# EasyEDA Pro project icl7109-rp2040-precision-meter_2025-05-16.epro, board icl7109-rp2040-precision-meter
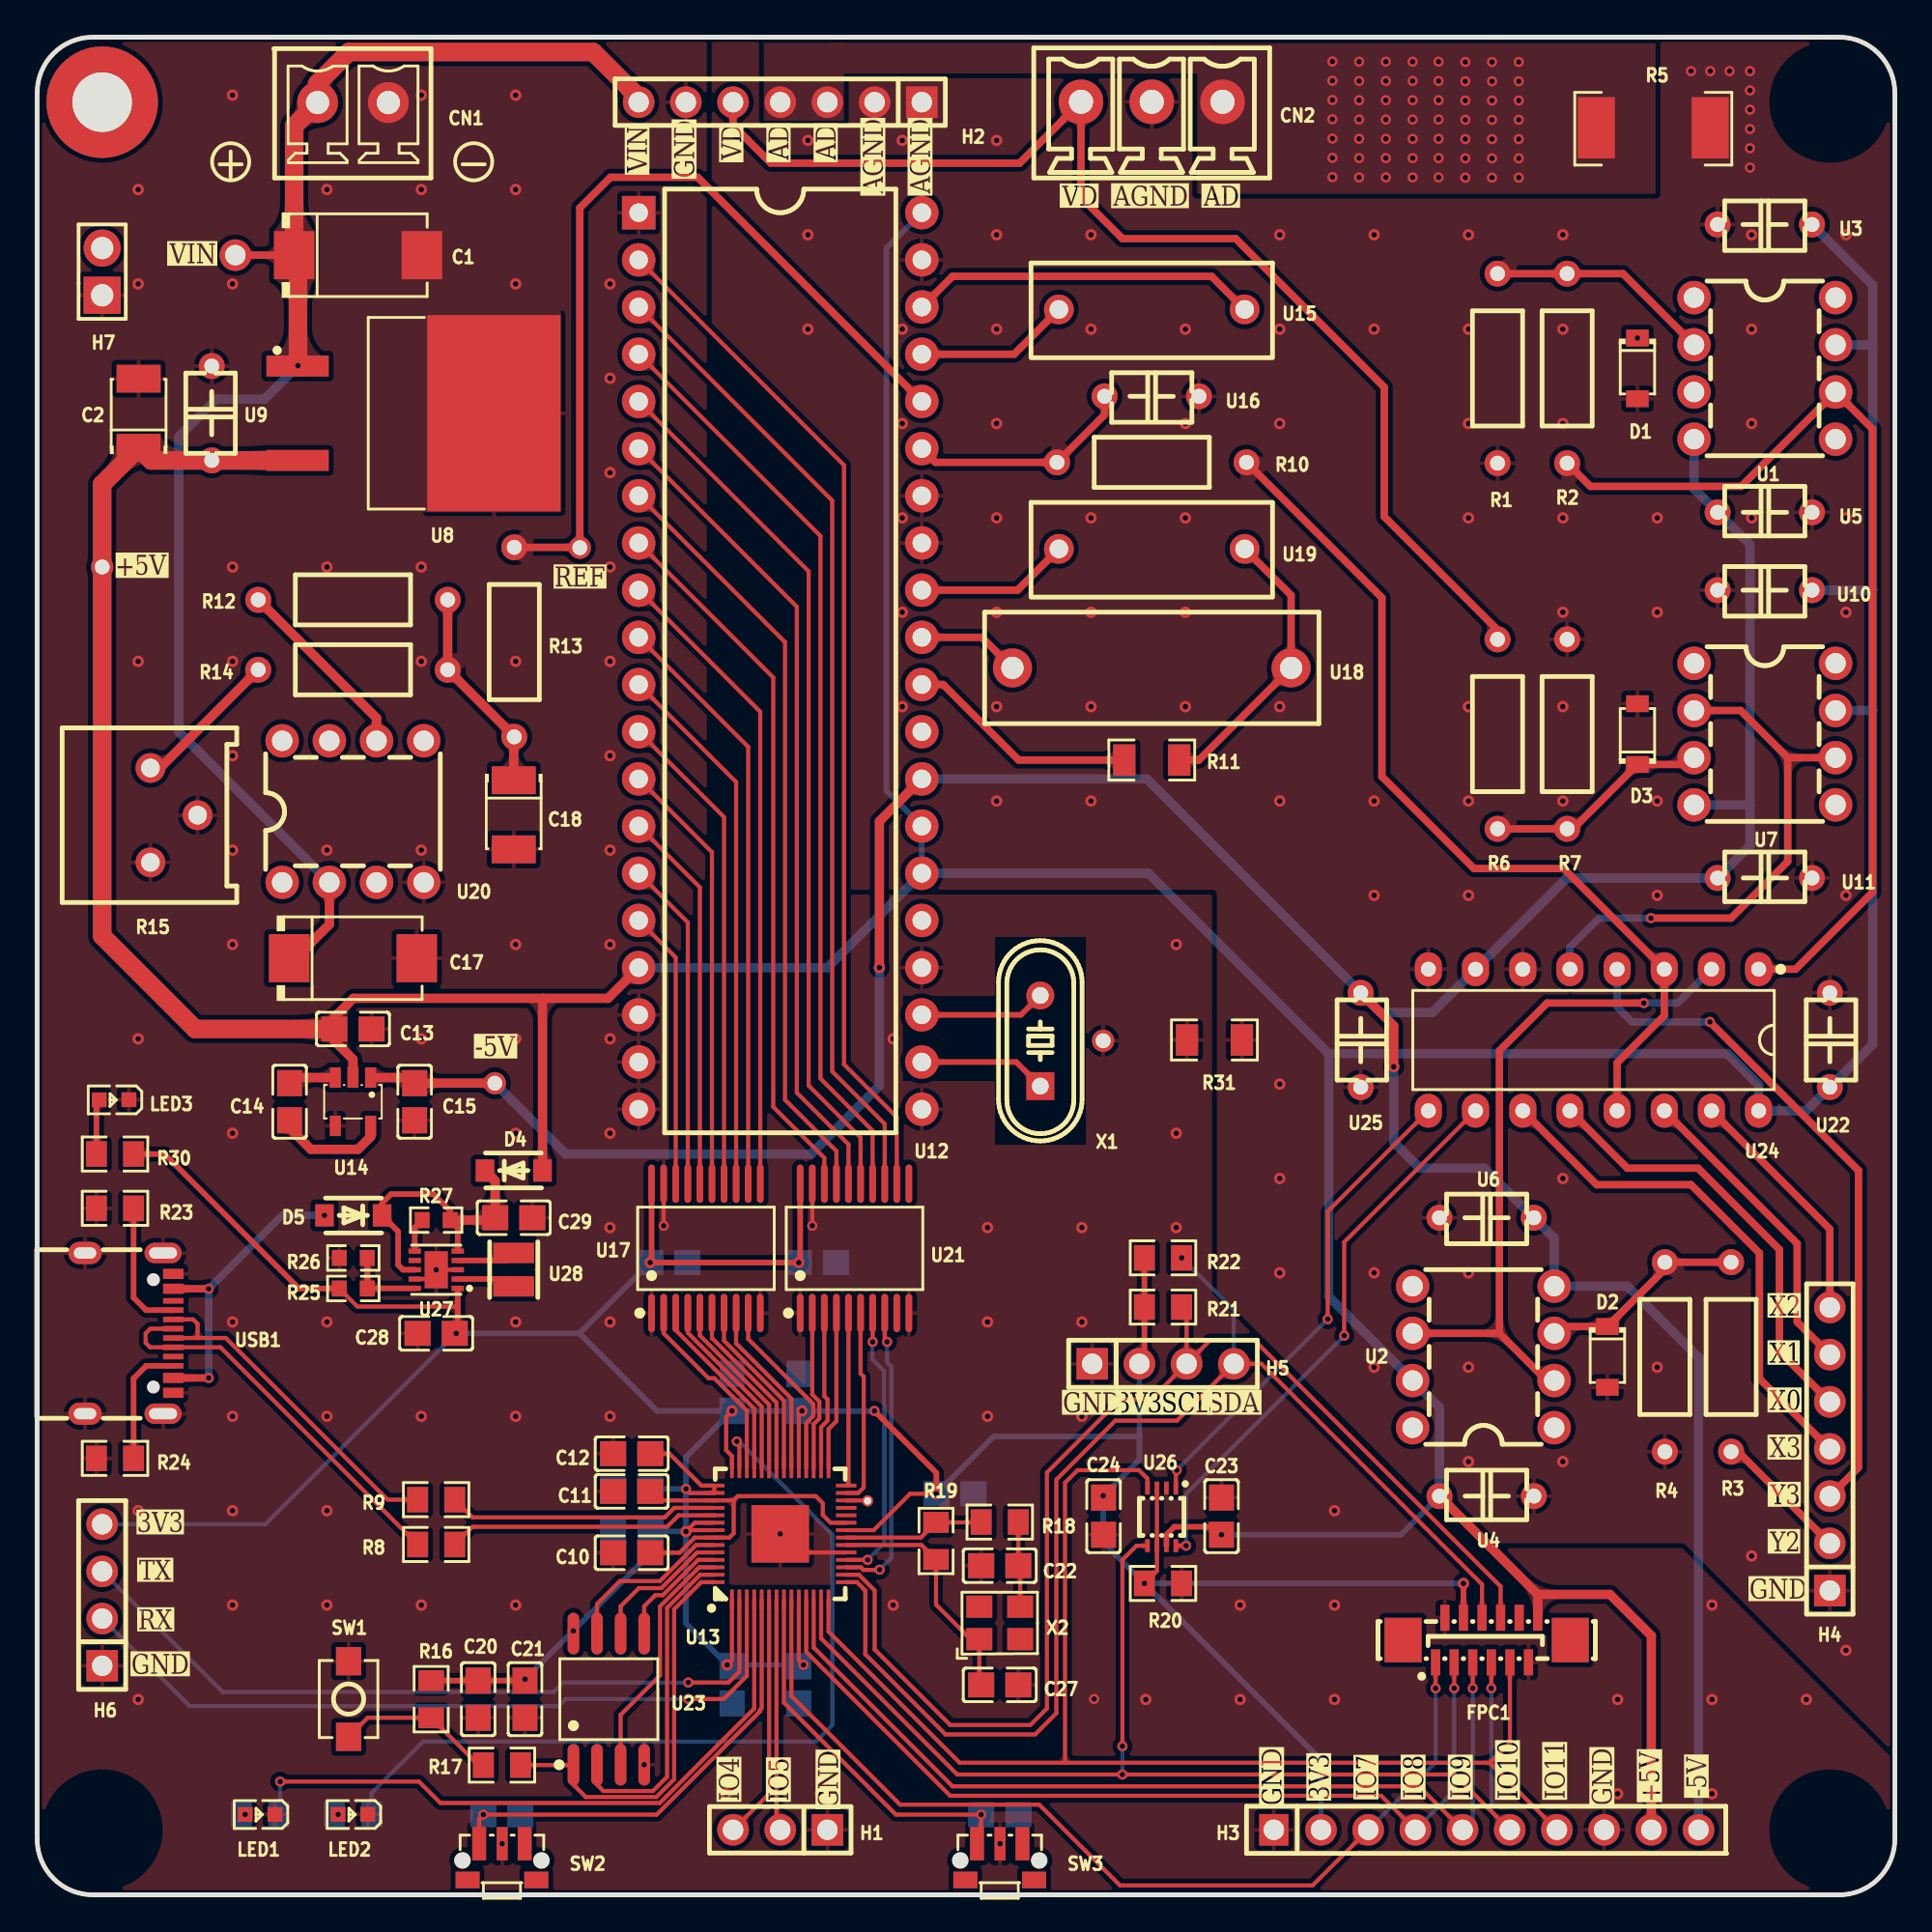
[diagram p1: board, top side]
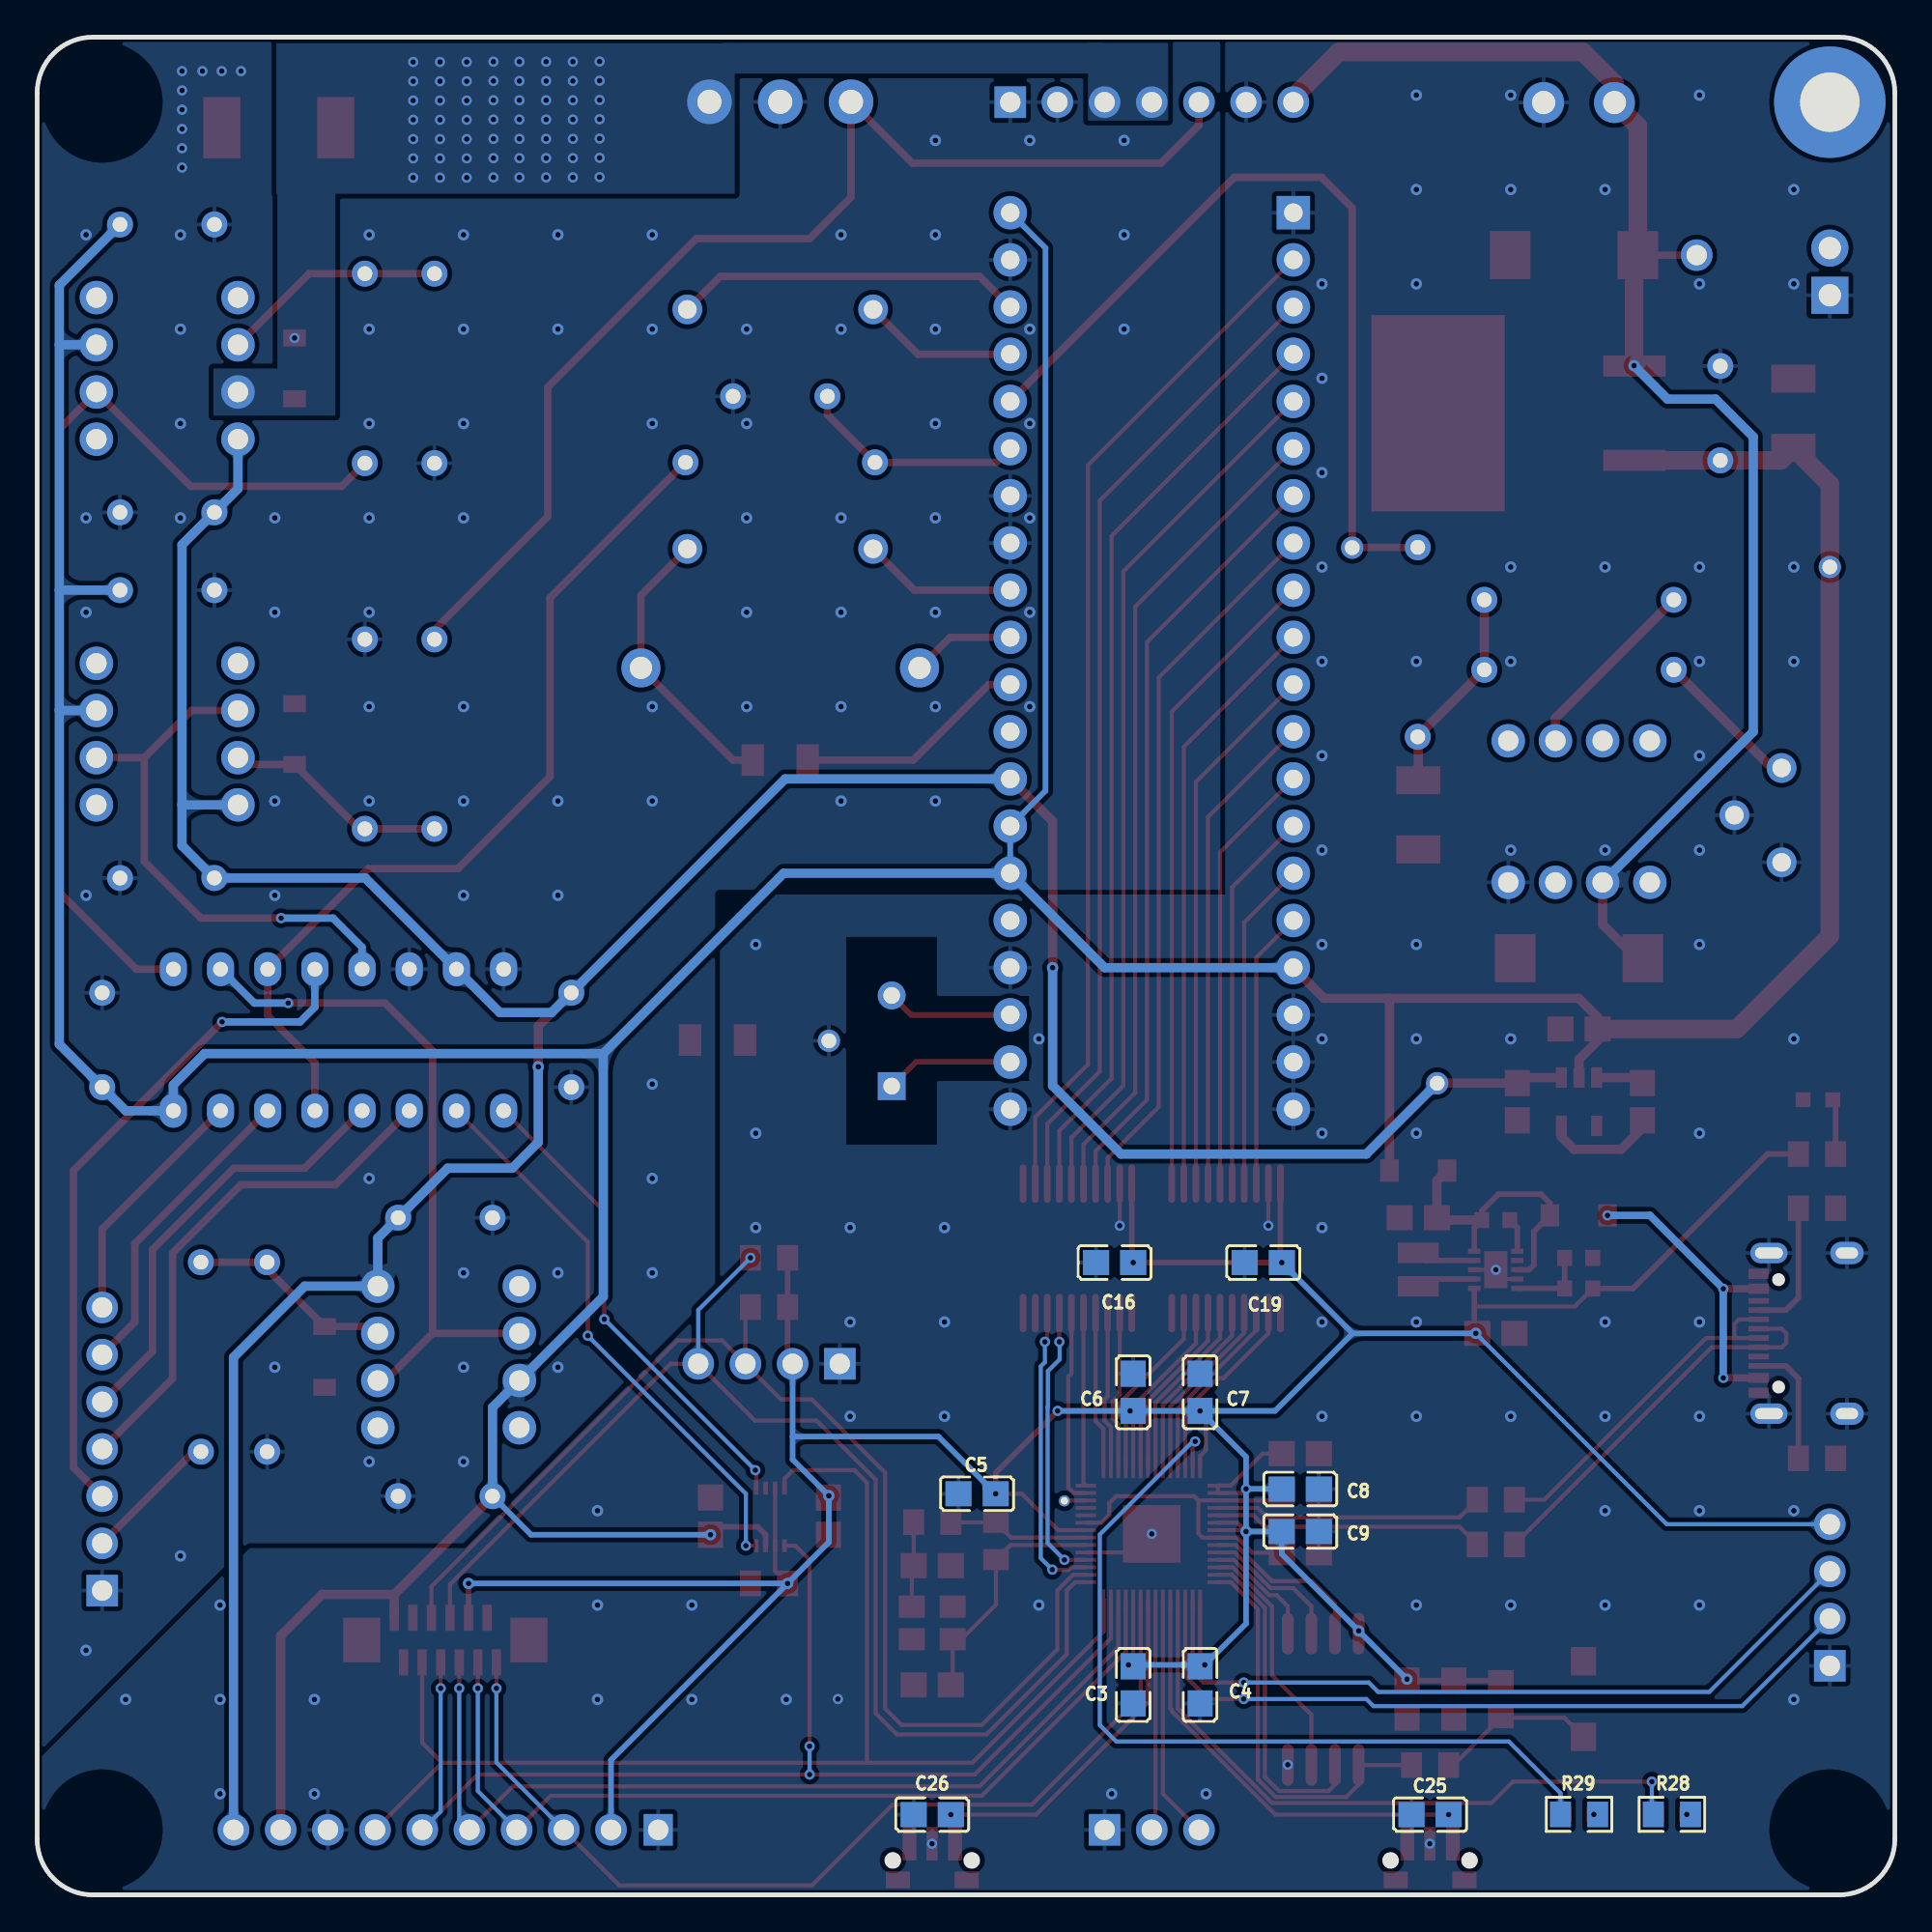
[diagram p2: board, bottom side, seen from below]

Outline 100 x 100 mm; copper layers: Top Layer, Bottom Layer. Coordinates in mm from the lower left corner of the outline.
Outline path: 0,97 0,3 arc(0.88,0.88) 3,0 97,0 arc(99.12,0.88) 100,3 100,97 arc(99.12,99.12) 97,100 3,100 arc(0.88,99.12) 0,97
Stack: Top Layer 0.035mm / Dielectric1 1.51mm FR4 er 4.5 / Bottom Layer 0.035mm

## Design rules (mm)
template: JLCPCB Capability(Two Layers Board)
spacing copperThickness1oz (default): track to track 0.102, other pairs 0.152 to 0.3
spacing copperThickness2oz: track to track 0.203, other pairs 0.152 to 0.3
track width copperThickness1oz (default): min 0.127, default 0.254, max 2.54
track width copperThickness2oz: min 0.203, default 0.254, max 2.54
differential pair differentialPair (default): width min 0.127, default 0.254, max 2.54; gap min 0.152, default 0.152
via viaSize (default): diameter min 0.5, default 0.61, max 10; hole min 0.3, default 0.305, max 6.3

## Placement (name value [footprint] x y rotation side)
C1  10uF  [CAP-SMD_L7.3-W4.3-FD]  17.27 88.27 0 top
C2  10uF  [case-b_3528]  5.46 79.76 90 top
C3  100nF  [C0805]  41 11.3 90 bottom
C4  100nF  [C0805]  37.4 11.3 90 bottom
C5  100nF  [C0805]  49.4 21.59 180 bottom
C6  100nF  [C0805]  41 27.05 270 bottom
C7  100nF  [C0805]  37.4 27.05 270 bottom
C8  100nF  [C0805]  32 21.84 0 bottom
C9  2.2uF  [C0805]  32 19.56 0 bottom
C10  100nF  [C0805]  32 18.41 0 top
C11  2.2uF  [C0805]  32 21.72 0 top
C12  2.2uF  [C0805]  32 23.75 0 top
C13  1uF  [C0805]  17 46.61 180 top
C14  1uF  [C0805]  13.59 42.69 270 top
C15  1uF  [C0805]  20.32 42.69 90 top
C16  100nF  [C0805]  42 34.04 0 bottom
C17  10uF  [CAP-SMD_L7.3-W4.3-FD]  17 50.42 0 top
C18  10uF  [case-b_3528]  25.65 58.14 270 top
C19  100nF  [C0805]  34 34.04 0 bottom
C20  2.2uF  [C0805]  23.74 10.53 90 top
C21  100nF  [C0805]  26.26 10.53 90 top
C22  20pF  [C0805]  51.82 17.72 180 top
C23  100nF  [C0805]  63.75 20.38 90 top
C24  100nF  [C0805]  57.4 20.38 90 top
C25  100nF  [C0805]  25.02 4.32 180 bottom
C26  100nF  [C0805]  51.82 4.32 180 bottom
C27  20pF  [C0805]  51.82 11.3 0 top
C28  47uF  [C0805]  21.48 30.23 180 top
C29  47uF  [C0805]  25.65 36.45 180 top
CN1  WJ15EDGVC-3.81-2P  [CONN-TH_WJ15EDGVC-3.81-2P]  17 96.48 0 top
CN2  WJ15EDGVC-3.81-3P  [CONN-TH_3P-P3.81_WJ15EDGVC-3.81-3P]  60 96.52 0 top
D1  BZT52-C5V1X  [SOD-123_L2.7-W1.6-LS3.7-RD]  86.14 82.17 270 top
D2  BZT52-C5V1X  [SOD-123_L2.7-W1.6-LS3.7-RD]  84.53 28.96 270 top
D3  BZT52-C5V1X  [SOD-123_L2.7-W1.6-LS3.7-RD]  86.14 62.48 90 top
D4  MBR120VLSFT1G  [SOD-123F_L2.8-W1.8-LS3.7-RD]  25.65 38.99 0 top
D5  MBR120VLSFT1G  [SOD-123F_L2.8-W1.8-LS3.7-RD]  17.02 36.58 180 top
FPC1  AFC11-S12ICA-00  [CONN-SMD-12P_AFC11-S12ICA-00]  78.03 13.72 0 top
H1  PZ254V-11-03P  [HDR-TH_3P-P2.54-V-M]  40 3.5 180 top
H2  PZ254V-11-07P  [HDR-TH_7P-P2.54-V-M]  40 96.5 180 top
H3  PZ254V-11-10P  [HDR-TH_10P-P2.54-V-M]  78 3.5 0 top
H4  PZ254V-11-07P  [HDR-TH_7P-P2.54-V-M]  96.5 24 90 top
H5  PZ254V-11-04P  [HDR-TH_4P-P2.54-V-M]  60.6 28.59 0 top
H6  PZ254V-11-04P  [HDR-TH_4P-P2.54-V-M]  3.5 16.14 90 top
H7  PZ254V-11-02P  [HDR-TH_2P-P2.54-V-M]  3.5 87.38 90 top
LED1  LTST-C190KSKT  [LED0603-RD]  12 4.33 180 top
LED2  LTST-C190KSKT  [LED0603-RD]  17 4.33 180 top
LED3  NCD0603R1  [LED0603-RD_RED]  4.14 42.8 180 top
NOREF  -  [Pad_e283]  29.21 72.52 0 top
NOREF#2  -  [Pad_e9]  3.5 96.5 0 top
NOREF#3  -  [Pad_e1596]  10.67 88.27 0 top
NOREF#4  -  [Pad_e3283]  3.5 71.48 0 top
NOREF#5  -  [Pad_e6313]  57.38 45.97 0 top
NOREF#6  -  [Pad_e2933]  24.64 43.69 0 top
NOREF#7  -  [Pad_e3660]  44.7 21.21 0 top
R1  825Ω  [RES-TH_BD2.7-L6.2-P10.20-D0.4]  78.61 82.17 270 top
R2  10kΩ  [RES-TH_BD2.7-L6.2-P10.20-D0.4]  82.36 82.17 90 top
R3  49.9kΩ  [RES-TH_BD2.7-L6.2-P10.20-D0.4]  91.19 28.96 270 top
R4  10kΩ  [RES-TH_BD2.7-L6.2-P10.20-D0.4]  87.62 28.96 90 top
R5  100mΩ  [RES-SMD_L6.4-W3.2-R2512]  87 95.12 180 top
R6  49.9kΩ  [RES-TH_BD2.7-L6.2-P10.20-D0.4]  78.61 62.48 90 top
R7  10kΩ  [RES-TH_BD2.7-L6.2-P10.20-D0.4]  82.36 62.48 270 top
R8  27Ω  [r0805]  21.48 18.86 0 top
R9  27Ω  [r0805]  21.48 21.27 0 top
R10  1kΩ  [RES-TH_BD2.7-L6.2-P10.20-D0.4]  60 77.11 180 top
R11  200kΩ  [R1206]  60 61.09 0 top
R12  18.9kΩ  [RES-TH_BD2.7-L6.2-P10.20-D0.4]  17 69.71 0 top
R13  0Ω  [RES-TH_BD2.7-L6.2-P10.20-D0.4]  25.68 67.44 90 top
R14  4.22kΩ  [RES-TH_BD2.7-L6.2-P10.20-D0.4]  17 65.95 0 top
R15  200Ω  [RES-ADJ-TH_3P-L9.5-W9.5-P2.54-BR-BS]  7.37 58.12 180 top
R16  NO-FIT  [r0805]  21.21 10.53 90 top
R17  1kΩ  [r0805]  25.02 6.99 0 top
R18  1kΩ  [r0805]  51.82 20.07 0 top
R19  NO-FIT  [r0805]  48.39 19.05 90 top
R20  10kΩ  [r0805]  60.6 16.76 0 top
R21  10kΩ  [r0805]  60.6 31.64 0 top
R22  10kΩ  [r0805]  60.6 34.29 0 top
R23  1kΩ  [r0805]  4.19 36.96 0 top
R24  1kΩ  [r0805]  4.19 23.5 0 top
R25  560kΩ  [R0603]  17.02 32.64 0 top
R26  100kΩ  [R0603]  17.02 34.28 180 top
R27  100kΩ  [R0603]  21.48 36.32 0 top
R28  3.3kΩ  [r0805]  12 4.33 0 bottom
R29  3.3kΩ  [r0805]  17 4.33 0 bottom
R30  3.3kΩ  [r0805]  4.19 39.88 180 top
R31  0Ω  [R1206]  63.37 46.02 180 top
SW1  HX TS342A2P WZ 250gf  [SW-SMD_L4.0-W2.9-LS5.0]  16.76 10.54 270 top
SW2  SKRTLAE010  [KEY-SMD_SKRTLAE010]  25.02 1.78 0 top
SW3  SKRTLAE010  [KEY-SMD_SKRTLAE010]  51.82 1.78 0 top
U1  LT1097CN8#PBF  [PDIP-8_L9.3-W6.4-P2.54-LS7.6-BL]  93 82.17 270 top
U2  LT1097CN8#PBF  [PDIP-8_L9.3-W6.4-P2.54-LS7.6-BL]  77.85 28.96 90 top
U3  100nF  [CAP-TH_L3.8-W2.5-P5.08-D0.50]  93 89.92 0 top
U4  100nF  [CAP-TH_L3.8-W2.5-P5.08-D0.50]  78.03 21.46 180 top
U5  100nF  [CAP-TH_L3.8-W2.5-P5.08-D0.50]  93 74.42 180 top
U6  100nF  [CAP-TH_L3.8-W2.5-P5.08-D0.50]  78.03 36.45 0 top
U7  LT1097CN8#PBF  [PDIP-8_L9.3-W6.4-P2.54-LS7.6-BL]  93 62.48 270 top
U8  L7805CD2T-TR  [TO-263-2_L10.0-W9.1-P5.08-LS15.2-TL]  19.3 79.76 0 top
U9  100nF  [CAP-TH_L3.8-W2.5-P5.08-D0.50]  9.4 79.76 270 top
U10  100nF  [CAP-TH_L3.8-W2.5-P5.08-D0.50]  93 70.23 0 top
U11  100nF  [CAP-TH_L3.8-W2.5-P5.08-D0.50]  93 54.74 180 top
U12  ICL7109CPL  [PDIP-40_L52.3-W13.8-P2.54-LS15.2-BL]  40 66.42 270 top
U13  RP2040  [LQFN-56_L7.0-W7.0-P0.4-EP]  40 19.43 90 top
U14  TPS60403QDBVRQ1  [SOT-23-5_L3.0-W1.7-P0.95-LS2.8-BR]  17 42.69 90 top
U15  1uF  [CAP-TH_L13.0-W5.0-P10.00-D0.6]  60 85.34 0 top
U16  10nF  [CAP-TH_L3.8-W2.5-P5.08-D0.50]  60 80.67 0 top
U17  SN74LVC245ADBR  [SSOP-20_L7.5-W5.2-P0.65-LS8.0-BL]  36 34.8 0 top
U18  330nF  [CAP-TH_L18.0-W6.0-P15.00-D0.8]  60 66.05 0 top
U19  150nF  [CAP-TH_L13.0-W5.0-P10.00-D0.6]  60 72.45 0 top
U20  LT1021BCN8-10#PBF  [PDIP-8_L9.3-W6.4-P2.54-LS7.6-BL]  17 58.31 0 top
U21  SN74LVC245ADBR  [SSOP-20_L7.5-W5.2-P0.65-LS8.0-BL]  44 34.8 0 top
U22  100nF  [CAP-TH_L3.8-W2.5-P5.08-D0.50]  96.5 46.02 90 top
U23  W25Q16JVSSIQ  [SOIC-8_L5.3-W5.3-P1.27-LS8.0-BL]  30.77 10.53 0 top
U24  XD14052  [DIP-16_L19.2-W6.6-P2.54-LS7.6-BL]  83.78 46.02 180 top
U25  100nF  [CAP-TH_L3.8-W2.5-P5.08-D0.50]  71.25 46.02 90 top
U26  TXS0102DCUR  [VSON8_L2.0-W2.3-P0.50-LS3.1-BL]  60.53 20.35 180 top
U27  RT6150BGQW  [WSON-10_L2.5-W2.5-P0.50-BL-EP]  21.48 33.65 90 top
U28  2.2uH  [IND-SMD_L2.5-W2.0-B]  25.65 33.66 270 top
USB1  TYPE-C 16PIN 2MD(073)  [USB-C-SMD_TYPE-C-6PIN-2MD-073]  4.95 30.23 270 top
X1  3.579545MHz  [HC-49US_L11.5-W4.5-P4.88]  54 45.97 90 top
X2  12MHz  [OSC-SMD_4P-L3.2-W2.5-BL]  51.82 14.64 0 top

## Footprints (pads in the part's own frame, mm; a bottom-side part is the same pattern mirrored in y, then rotated)
C0805
  rect 1.41x1.35 smd: 1(-1,0) 2(1,0)
CAP-SMD_L7.3-W4.3-FD
  rect 2.185x2.592 smd: 1(-3.437,0) 2(3.437,0)
CAP-TH_L3.8-W2.5-P5.08-D0.50
  round 1.4 hole 0.8: 1(-2.54,0) 2(2.54,0)
CAP-TH_L13.0-W5.0-P10.00-D0.6
  round 1.6 hole 1: 1(-5,0) 2(5,0)
CAP-TH_L18.0-W6.0-P15.00-D0.8
  round 2.1 hole 1.2: 1(-7.5,0) 2(7.5,0)
case-b_3528
  rect 1.506x2.376 smd: 1(-1.861,0) 2(1.861,0)
CONN-SMD-12P_AFC11-S12ICA-00
  rect 0.5x1.4 smd: 1(-2.75,-1.2) 2(-2.249,1.2) 3(-1.75,-1.2) 4(-1.25,1.2) 5(-0.75,-1.2) 6(-0.25,1.2) 7(0.25,-1.2) 8(0.75,1.2) 9(1.25,-1.2) 10(1.75,1.2) 11(2.25,-1.2) 12(2.751,1.2)
  rect 2x2.4 smd: 13(4.5,0) 14(-4.5,0)
CONN-TH_3P-P3.81_WJ15EDGVC-3.81-3P
  round 2.4 hole 1.3: 1(-3.81,0) 2(0,0) 3(3.81,0)
CONN-TH_WJ15EDGVC-3.81-2P
  round 2.2 hole 1.25: 1(-1.905,0) 2(1.905,0)
DIP-16_L19.2-W6.6-P2.54-LS7.6-BL
  oval 1.46x1.825 hole 0.8: 1(-8.89,-3.81) 2(-6.35,-3.81) 3(-3.81,-3.81) 4(-1.27,-3.81) 5(1.27,-3.81) 6(3.81,-3.81) 7(6.35,-3.81) 8(8.89,-3.81) 9(8.89,3.81) 10(6.35,3.81) 11(3.81,3.81) 12(1.27,3.81) 13(-1.27,3.81) 14(-3.81,3.81) 15(-6.35,3.81) 16(-8.89,3.81)
HC-49US_L11.5-W4.5-P4.88
  rect 1.5x1.5 hole 0.9: 1(-2.44,0)
  round 1.5 hole 0.9: 2(2.44,0)
HDR-TH_2P-P2.54-V-M
  rect 2x2 hole 1.2: 1(-1.27,0)
  round 2 hole 1.2: 2(1.27,0)
HDR-TH_3P-P2.54-V-M
  rect 1.7x1.7 hole 1.1: 1(-2.54,0)
  round 1.7 hole 1.1: 2(0,0) 3(2.54,0)
HDR-TH_4P-P2.54-V-M
  rect 1.7x1.7 hole 1.1: 1(-3.81,0)
  round 1.7 hole 1.1: 2(-1.27,0) 3(1.27,0) 4(3.81,0)
HDR-TH_7P-P2.54-V-M
  rect 1.7x1.7 hole 1.1: 1(-7.62,0)
  round 1.7 hole 1.1: 2(-5.08,0) 3(-2.54,0) 4(0,0) 5(2.54,0) 6(5.08,0) 7(7.62,0)
HDR-TH_10P-P2.54-V-M
  rect 1.575x1.7 hole 1.1: 1(-11.43,0)
  round 1.7 hole 1.1: 2(-8.89,0) 3(-6.35,0) 4(-3.81,0) 5(-1.27,0) 6(1.27,0) 7(3.81,0) 8(6.35,0) 9(8.89,0) 10(11.43,0)
IND-SMD_L2.5-W2.0-B
  rect 1.1x2.2 smd: 1(-0.9,0) 2(0.9,0)
KEY-SMD_SKRTLAE010
  rect 0.75x1.8 smd: 1(-1.225,0.975) 3(1.225,0.975)
  rect 0.6x1.8 smd: 2(0.015,0.975)
  rect 1.3x0.9 smd: 4(-1.85,-0.975) 5(1.85,-0.975)
LED0603-RD
  rect 0.8x0.8 smd: 1(-0.799,0) 2(0.799,0)
LED0603-RD_RED
  rect 0.8x0.8 smd: 1(-0.799,-0.004) 2(0.799,0.004)
LQFN-56_L7.0-W7.0-P0.4-EP
  rect 1.1x0.2 smd: 1(-3.55,2.6) 2(-3.55,2.2) 3(-3.55,1.8) 4(-3.55,1.4) 5(-3.55,1) 6(-3.55,0.6) 7(-3.55,0.2) 8(-3.55,-0.2) 9(-3.55,-0.6) 10(-3.55,-1) 11(-3.55,-1.4) 12(-3.55,-1.8) 13(-3.55,-2.2) 14(-3.55,-2.6) 29(3.55,-2.6) 30(3.55,-2.2) 31(3.55,-1.8) 32(3.55,-1.4) 33(3.55,-1) 34(3.55,-0.6) 35(3.55,-0.2) 36(3.55,0.2) 37(3.55,0.6) 38(3.55,1) 39(3.55,1.4) 40(3.55,1.8) 41(3.55,2.2) 42(3.55,2.6)
  rect 0.2x1.1 smd: 15(-2.6,-3.55) 16(-2.2,-3.55) 17(-1.8,-3.55) 18(-1.4,-3.55) 19(-1,-3.55) 20(-0.6,-3.55) 21(-0.2,-3.55) 22(0.2,-3.55) 23(0.6,-3.55) 24(1,-3.55) 25(1.4,-3.55) 26(1.8,-3.55) 27(2.2,-3.55) 28(2.6,-3.55) 43(2.6,3.55) 44(2.2,3.55) 45(1.8,3.55) 46(1.4,3.55) 47(1,3.55) 48(0.6,3.55) 49(0.2,3.55) 50(-0.2,3.55) 51(-0.6,3.55) 52(-1,3.55) 53(-1.4,3.55) 54(-1.8,3.55) 55(-2.2,3.55) 56(-2.6,3.55)
  rect 3.1x3.1 smd: 57(0,0)
OSC-SMD_4P-L3.2-W2.5-BL
  rect 1.4x1.2 smd: 1(-1.1,-0.875) 2(1.1,-0.875) 3(1.1,0.875) 4(-1.1,0.875)
Pad_e9
  round 6 hole 3.2: 1(0,0)
Pad_e283
  round 1.2 hole 0.8: 1(0,0)
Pad_e1596
  round 1.7 hole 1.1: 1(0,0)
Pad_e2933
  round 1.2 hole 0.8: 1(0,0)
Pad_e3283
  round 1.2 hole 0.8: 1(0,0)
Pad_e3660
  round 0.6 hole 0.4: 1(0,0)
Pad_e6313
  round 1.2 hole 0.8: 1(0,0)
PDIP-8_L9.3-W6.4-P2.54-LS7.6-BL
  round 1.8 hole 1.1: 1(-3.81,-3.81) 2(-1.27,-3.81) 3(1.27,-3.81) 4(3.81,-3.81) 5(3.81,3.81) 6(1.27,3.81) 7(-1.27,3.81) 8(-3.81,3.81)
PDIP-40_L52.3-W13.8-P2.54-LS15.2-BL
  rect 1.8x1.8 hole 1: 1(-24.13,-7.62)
  round 1.8 hole 1: 2(-21.59,-7.62) 3(-19.05,-7.62) 4(-16.51,-7.62) 5(-13.97,-7.62) 6(-11.43,-7.62) 7(-8.89,-7.62) 8(-6.35,-7.62) 9(-3.81,-7.62) 10(-1.27,-7.62) 11(1.27,-7.62) 12(3.81,-7.62) 13(6.35,-7.62) 14(8.89,-7.62) 15(11.43,-7.62) 16(13.97,-7.62) 17(16.51,-7.62) 18(19.05,-7.62) 19(21.59,-7.62) 20(24.13,-7.62) 21(24.13,7.62) 22(21.59,7.62) 23(19.05,7.62) 24(16.51,7.62) 25(13.97,7.62) 26(11.43,7.62) 27(8.89,7.62) 28(6.35,7.62) 29(3.81,7.62) 30(1.27,7.62) 31(-1.27,7.62) 32(-3.81,7.62) 33(-6.35,7.62) 34(-8.89,7.62) 35(-11.43,7.62) 36(-13.97,7.62) 37(-16.51,7.62) 38(-19.05,7.62) 39(-21.59,7.62) 40(-24.13,7.62)
R0603
  rect 0.806x0.864 smd: 1(-0.753,0) 2(0.753,0)
r0805
  rect 1.133x1.377 smd: 1(-1,0) 2(1,0)
R1206
  rect 1.208x1.701 smd: 1(-1.479,0) 2(1.479,0)
RES-ADJ-TH_3P-L9.5-W9.5-P2.54-BR-BS
  round 1.6 hole 1: 1(1.27,-2.54) 2(-1.27,0) 3(1.27,2.54)
RES-SMD_L6.4-W3.2-R2512
  rect 2x3.3 smd: 1(-3.067,0) 2(3.067,0)
RES-TH_BD2.7-L6.2-P10.20-D0.4
  round 1.4 hole 0.8: 1(-5.1,0) 2(5.1,0)
SOD-123_L2.7-W1.6-LS3.7-RD
  rect 0.91x1.22 smd: 1(-1.635,0) 2(1.635,0)
SOD-123F_L2.8-W1.8-LS3.7-RD
  rect 1x1.2 smd: 1(-1.55,0) 2(1.55,0)
SOIC-8_L5.3-W5.3-P1.27-LS8.0-BL
  oval 0.63x2.25 smd: 1(-1.905,-3.53) 2(-0.635,-3.53) 3(0.635,-3.53) 4(1.905,-3.53) 5(1.905,3.53) 6(0.635,3.53) 7(-0.635,3.53) 8(-1.905,3.53)
SOT-23-5_L3.0-W1.7-P0.95-LS2.8-BR
  rect 1.1x0.6 smd: 1(1.3,-0.95) 2(1.3,0) 3(1.3,0.95) 4(-1.3,0.95) 5(-1.3,-0.95)
SSOP-20_L7.5-W5.2-P0.65-LS8.0-BL
  oval 0.364x2.069 smd: 1(-2.925,-3.482) 2(-2.275,-3.482) 3(-1.625,-3.482) 4(-0.975,-3.482) 5(-0.325,-3.482) 6(0.325,-3.482) 7(0.975,-3.482) 8(1.625,-3.482) 9(2.275,-3.482) 10(2.925,-3.482) 11(2.925,3.482) 12(2.275,3.482) 13(1.625,3.482) 14(0.975,3.482) 15(0.325,3.482) 16(-0.325,3.482) 17(-0.975,3.482) 18(-1.625,3.482) 19(-2.275,3.482) 20(-2.925,3.482)
SW-SMD_L4.0-W2.9-LS5.0
  rect 1.53x1.36 smd: 1(-2.035,0) 2(2.035,0)
TO-263-2_L10.0-W9.1-P5.08-LS15.2-TL
  rect 3.358x1.134 smd: 1(-5.286,2.54) 3(-5.286,-2.54)
  rect 7.181x10.566 smd: 4(5.286,0)
USB-C-SMD_TYPE-C-6PIN-2MD-073
  rect 0.55x1.1 smd: 1(-3.2,2.375) 2(-2.4,2.375) 11(2.4,2.375) 12(3.2,2.375)
  rect 0.3x1.1 smd: 3(-1.75,2.375) 4(-1.25,2.375) 5(-0.75,2.375) 6(-0.25,2.375) 7(0.25,2.375) 8(0.75,2.375) 9(1.25,2.375) 10(1.75,2.375)
  oval 1.1x2 hole 0.6x1.5: 13(-4.325,1.825) 14(4.325,1.825)
  oval 1.2x1.8 hole 0.6x1.2: 13(-4.325,-2.375) 14(4.325,-2.375)
VSON8_L2.0-W2.3-P0.50-LS3.1-BL
  rect 0.25x0.7 smd: 1(-0.762,-1.55) 2(-0.254,-1.55) 3(0.254,-1.55) 4(0.762,-1.55) 5(0.762,1.55) 6(0.254,1.55) 7(-0.254,1.55) 8(-0.762,1.55)
WSON-10_L2.5-W2.5-P0.50-BL-EP
  rect 0.28x0.665 smd: 1(-1,-1.157) 2(-0.5,-1.157) 3(0,-1.157) 4(0.5,-1.157) 5(1,-1.157) 6(1,1.157) 7(0.5,1.157) 8(0,1.157) 9(-0.5,1.157) 10(-1,1.157)
  rect 2x1.25 smd: 11(0,0)

## Nets
As in the schematic, except:
+5V: C2.1 C13.2 C23.1 D4.2 FPC1.12 H3.9 NOREF#4.1 U1.7 U2.7 U3.2 U4.2 U7.7 U8.3 U9.2 U10.2 U12.17 U12.26 U12.27 U12.40 U14.2 U22.1 U24.16 U26.7
-5V: C15.2 H3.10 NOREF#6.1 U1.4 U2.4 U5.2 U6.2 U7.4 U11.2 U12.28 U14.1 U24.7 U25.2
GND: C1.2 C2.2 C3.1 C4.1 C5.1 C6.1 C7.1 C8.1 C9.1 C10.1 C11.1 C12.1 C13.1 C15.1 C16.2 C17.2 C18.2 C19.2 C20.1 C21.1 C22.2 C23.2 C24.1 C25.1 C26.1 C27.2 C28.2 C29.1 CN1.2 FPC1.2 FPC1.11 H1.1 H2.6 H3.1 H3.8 H5.1 H6.1 H7.1 LED1.1 LED2.1 LED3.1 NOREF#5.1 R15.2 R15.3 R20.2 R23.1 R24.1 R26.2 R31.2 SW1.1 SW2.2 SW3.2 U8.4 U9.1 U12.1 U12.18 U12.19 U12.20 U12.21 U12.24 U13.19 U13.57 U14.4 U17.1 U17.10 U17.19 U20.4 U21.1 U21.10 U21.19 U23.4 U26.2 U27.3 U27.9 U27.11 USB1.1 USB1.12 USB1.13 USB1.14
VIN: C1.1 C17.1 CN1.1 H2.7 NOREF#3.1 U8.1 U20.2
REF_IN+: NOREF.1 R13.2 U12.36
RUN: NOREF#7.1 U13.26

Pads without a net: FPC1 10 13 14; H7 2; NOREF#2 1; SW2 3 4 5; SW3 3 4 5; U1 1 5 8; U2 1 5 8; U7 1 5 8; U12 25 29; U20 1 3 5 7 8; U21 9 11; U27 7; USB1 3 9; X2 2 4

## Via types
v1: diameter 0.61, hole 0.305, Top Layer to Bottom Layer, 175 vias
v2: diameter 0.55, hole 0.3, Top Layer to Bottom Layer, 106 vias

## Routing (per net, layer and track width the routed paths; a pad name or vN(x,y) marks a point on that pad's centre or on a via; arc(x,y) is an arc through that point)
+1.1V: length 18.5
  Top Layer w0.22: C10.2 34.58,18.41 35.4,19.23 U13.50 37.26,19.23 37.49,19.46 37.49,21.24 ; C11.2 33.49,21.23 U13.45 36.46,21.24 37.49,21.24 ; 37.49,21.24 37.72,21.46 41.91,21.46 42.29,21.08 42.29,20.45 42.71,20.03 U13.23
+3.3V: length 239.9
  Top Layer w0.22: U13.49 35,19.63 35.4,20.03 U13.48 ; v1(59.6,16.76) 60.28,17.44 U26.6 U26.3 ; v2(41.25,12.38) 41,12.63 U13.10 ; 41,22.98 41,25.88 v1(41.17,26.05) ; C12.2 34.04,23.75 35.75,22.03 U13.43 U13.44 35.15,21.63 v2(34.93,21.85) ; U13.22 45.03,19.63 46.99,21.59 v1(48.4,21.59) ; 22.64,31.67 17.24,31.67 R25.1 ; v1(37.15,12.38) 37.4,12.63 U13.1 ; v1(37.4,26.05) 37.09,25.74 37.09,23.93 37.4,23.62 37.4,22.98
  Top Layer w0.3: v2(45.07,26.05) 48.4,22.72 v1(48.4,21.59) ; v1(26.26,11.61) 26.18,11.53 C20.2 R16.2 ; FPC1.4 v1(76.78,16.76) ; U17.20 33.07,34.11 v1(33,34.04) v1(41,34.04) 41.07,34.11 U21.20 ; R22.1 R21.1 59.6,28.86 H5.2 ; R25.1 14.1,32.64 6.86,39.88 R30.1 ; C28.1 22.64,30.39 U27.1
  Bottom Layer w0.22: v1(22.56,30.23) 12.28,19.95 H6.4
  Bottom Layer w0.3: v1(37.4,26.05) 34.93,23.58 v2(34.93,21.85) ; v1(37.4,26.05) C6.2 v1(41.17,26.05) v2(45.07,26.05) ; v1(37.4,26.05) 33.37,26.05 29.19,30.23 ; v1(26.26,11.61) v1(28.86,14.21) 33,18.35 C9.2 v1(34.93,19.56) ; v1(76.78,16.76) v1(59.6,16.76) ; v1(59.6,16.76) 69.11,7.26 H3.2 ; v1(59.6,16.76) 57.38,18.98 v1(57.38,21.48) 59.33,23.43 59.33,24.67 ; v1(34.93,19.56) 34.93,14.6 v1(37.15,12.38) v2(41.25,12.38) ; v1(34.93,19.56) v2(34.93,21.85) ; 59.33,24.67 H5.2 ; 59.33,24.67 51.48,24.67 v1(48.4,21.59) ; v2(34.93,21.85) 33.01,21.85 C8.2 ; v1(22.56,30.23) 29.19,30.23 ; 29.19,30.23 v1(33,34.04)
+5V: length 316
  Top Layer w0.3: v1(63.75,19.38) 63.33,19.81 61.21,19.81 60.79,19.38 U26.7
  Top Layer w0.5: 27.22,48.26 30.73,48.26 U12.17 ; 27.22,48.26 17.02,48.26 16,47.24 C13.2 16,45.98 17,44.98 U14.2 ; 27.22,48.26 27.2,48.24 D4.2 ; H3.9 86.89,13.95 84.67,16.17 80.78,16.17 ; 80.78,16.17 U4.2 ; 80.78,16.17 FPC1.12
  Top Layer w1: U8.3 U9.2 6.14,77.22 C2.1 3.5,75.93 NOREF#4.1 3.5,51.62 8.51,46.61 C13.2
  Bottom Layer w0.3: U12.26 U12.27 45.72,59.43 45.72,88.65 U12.40 ; v1(63.75,19.38) 73.41,19.38 U4.2
  Bottom Layer w0.5: 98.81,63.79 98.81,45.78 U22.1 95.23,42.21 U24.16 92.67,43.6 90.99,45.28 69.52,45.28 ; 98.81,63.79 98.78,63.75 U7.7 ; 98.81,63.79 98.81,70.25 ; U12.17 42.54,49.91 U12.26 59.82,54.99 69.52,45.28 ; U10.2 98.79,70.23 98.81,70.25 ; 69.52,45.28 69.52,32.2 U2.7 75.49,26.24 U4.2 ; 98.81,70.25 98.81,83.44 ; 98.81,83.44 98.8,83.44 U1.7 ; 98.81,83.44 98.81,86.65 U3.2
-5V: length 184.7
  Top Layer w0.5: U25.2 73.03,46.78 v1(73.03,44.58) ; 24.64,43.81 24.52,43.69 C15.2 20.02,43.99 U14.1 ; v1(45.34,49.91) 45.34,57.79 U12.28
  Bottom Layer w0.5: 92.2,58.68 92.2,72.68 U5.2 89.19,75.69 U1.4 ; 92.2,58.68 92.2,58.67 U7.4 ; 92.2,58.68 92.2,56.48 U11.2 82.34,54.74 U24.7 75.1,47.5 72.31,47.5 U25.2 59.73,60.07 U12.28 ; NOREF#6.1 28.45,39.88 41.66,39.88 45.34,43.56 v1(45.34,49.91) ; H3.10 89.43,28.93 85.6,32.77 U2.4 81.66,35.35 77.9,39.12 74.42,39.12 73.03,40.51 v1(73.03,44.58)
AGND:
  vias: v1(41.49,94.44) v1(41.49,89.36) v1(41.49,84.28) v1(46.57,94.44) v1(46.57,84.28) v1(46.57,79.2) v1(46.57,74.12) v1(46.57,69.04) v1(46.57,63.96) v1(51.65,94.44) v1(51.65,89.36) v1(51.65,84.28) v1(51.65,79.2) v1(51.65,74.12) v1(51.65,69.04) v1(51.65,63.96) v1(51.65,58.88) v1(56.73,89.36) v1(56.73,84.28) v1(56.73,74.12) v1(56.73,69.04) v1(56.73,63.96) v1(56.73,58.88) v1(61.81,84.28) v1(61.81,79.2) v1(61.81,74.12) v1(61.81,69.04) v1(61.81,63.96) v1(66.89,89.36) v1(66.89,84.28) v1(66.89,79.2) v1(66.89,63.96) v1(66.89,58.88) v1(66.89,43.64) v1(66.89,38.56) v1(66.89,33.48) v1(71.97,89.36) v1(71.97,84.28) v1(71.97,58.88) v1(71.97,53.8) v1(71.97,33.48) v1(71.97,28.4) v1(77.05,89.36) v1(77.05,84.28) v1(77.05,79.2) v1(77.05,74.12) v1(77.05,63.96) v1(77.05,58.88) v1(77.05,53.8) v1(77.05,33.48) v1(77.05,28.4) v1(77.05,23.32) v1(82.13,89.36) v1(82.13,84.28) v1(82.13,79.2) v1(82.13,74.12) v1(82.13,69.04) v1(82.13,63.96) v1(82.13,58.88) v1(82.13,38.56) v1(82.13,23.32) v1(87.21,74.12) v1(87.21,69.04) v1(87.21,58.88) v1(87.21,53.8) v1(87.21,28.4) v1(92.29,89.36) v1(92.29,84.28) v1(92.29,79.2) v1(92.29,74.12) v1(92.29,18.24) v1(97.37,89.36) v1(97.37,74.12) v1(97.37,69.04) v1(97.37,53.8) v1(97.37,13.16) v2(89.03,98.17) v2(90.06,98.17) v2(91.1,98.17) v2(92.2,98.17) v2(92.2,97.13) v2(92.2,96.09) v2(92.2,95.06) v2(92.2,94.02) v2(92.2,92.98)
GND: length 11
  Top Layer w0.22: v2(40,19.43) 41,18.43 U13.19 ; U21.19 v2(41.72,36.02) ; U27.3 v2(21.48,33.65) 20.98,33.15 U27.9 ; U17.19 v2(33.72,36.02)
  vias: v1(5.44,91.8) v1(5.44,86.72) v1(5.44,71.48) v1(5.44,66.4) v1(5.44,46.08) v1(5.44,20.68) v1(5.44,10.52) v1(10.52,96.88) v1(10.52,86.72) v1(10.52,71.48) v1(10.52,66.4) v1(10.52,61.32) v1(10.52,56.24) v1(10.52,51.16) v1(10.52,41) v1(10.52,30.84) v1(10.52,25.76) v1(10.52,20.68) v1(10.52,15.6) v1(15.6,91.8) v1(15.6,71.48) v1(15.6,56.24) v1(15.6,30.84) v1(15.6,25.76) v1(15.6,20.68) v1(15.6,15.6) v1(20.68,96.88) v1(20.68,91.8) v1(20.68,71.48) v1(20.68,66.4) v1(20.68,56.24) v1(20.68,46.08) v1(20.68,25.76) v1(20.68,15.6) v1(25.76,96.88) v1(25.76,91.8) v1(25.76,86.72) v1(25.76,66.4) v1(25.76,51.16) v1(25.76,46.08) v1(25.76,41) v1(25.76,30.84) v1(25.76,25.76) v1(25.76,15.6) v1(30.84,86.72) v1(30.84,81.64) v1(30.84,76.56) v1(30.84,71.48) v1(30.84,66.4) v1(30.84,61.32) v1(30.84,56.24) v1(30.84,51.16) v1(30.84,46.08) v1(30.84,41) v1(30.84,35.92) v1(30.84,30.84) v1(30.84,25.76) v1(37.08,5.44) v1(42.16,5.44) v1(46.08,46.08) v1(46.08,15.6) v1(51.16,35.92) v1(51.16,30.84) v1(51.16,25.76) v1(56.24,35.92) v1(56.24,30.84) v1(56.24,25.76) v1(59.68,10.52) v1(61.32,51.16) v1(61.32,41) v1(61.32,35.92) v1(64.76,15.6) v1(64.76,10.52) v1(69.84,20.68) v1(69.84,15.6) v1(69.84,10.52) v1(85.08,10.52) v1(85.08,5.44) v1(90.16,15.6) v1(90.16,10.52) v1(90.16,5.44) v1(95.24,10.52) v2(25.03,2.75) v2(32.68,7) v2(51.83,2.75) v2(56.9,10.54)
V2_DIV: length 7.4
  Top Layer w0.4: R3.2 91.56,23.86 H4.2
V2_INPUT_HI: length 37.1
  Top Layer w0.4: 78.71,30.23 78.71,45.44 81.28,48.01 v2(86.49,48.01) ; 78.71,30.23 U2.6 ; 78.71,30.23 81.25,27.69 U2.2
  Bottom Layer w0.4: U24.2 88.31,48.01 v2(86.49,48.01)
VIN: length 78.4
  Top Layer w0.4: 14.04,88.27 C1.1 NOREF#3.1
  Top Layer w0.5: U20.2 15.73,52.24 14.04,50.55
  Top Layer w1: H2.7 32.38,96.75 29.93,99.2 16.78,99.2 15.09,97.52 CN1.1 13.84,95.22 C1.1 ; 14.04,88.27 v1(14.04,82.32) U8.1
  Bottom Layer w0.5: v1(14.04,82.32) 12.24,80.52 9.65,80.52 7.62,78.49 7.62,62.61 U20.2
A: length 30.4
  Top Layer w0.22: v2(70.36,30.1) 70.36,35.14 U24.10 ; U26.8 v2(61.85,18.8)
  Bottom Layer w0.22: v2(61.85,18.8) 61.85,21.59 v2(70.36,30.1)
A_DIV:
  vias: v2(69.72,98.69) v2(69.72,97.65) v2(69.72,96.62) v2(69.72,95.58) v2(69.72,94.54) v2(69.72,93.5) v2(69.72,92.46) v2(71.16,98.68) v2(71.16,97.64) v2(71.16,96.6) v2(71.16,95.56) v2(71.16,94.53) v2(71.16,93.49) v2(71.16,92.45) v2(72.6,98.68) v2(72.6,97.64) v2(72.6,96.6) v2(72.6,95.56) v2(72.6,94.53) v2(72.6,93.49) v2(72.6,92.45) v2(74.04,98.68) v2(74.04,97.64) v2(74.04,96.6) v2(74.04,95.56) v2(74.04,94.53) v2(74.04,93.49) v2(74.04,92.45) v2(75.44,98.68) v2(75.44,97.64) v2(75.44,96.6) v2(75.44,95.56) v2(75.44,94.53) v2(75.44,93.49) v2(75.44,92.45) v2(76.88,98.67) v2(76.88,97.63) v2(76.88,96.59) v2(76.88,95.55) v2(76.88,94.51) v2(76.88,93.47) v2(76.88,92.44) v2(78.32,98.67) v2(78.32,97.63) v2(78.32,96.59) v2(78.32,95.55) v2(78.32,94.51) v2(78.32,93.47) v2(78.32,92.44) v2(79.76,98.67) v2(79.76,97.63) v2(79.76,96.59) v2(79.76,95.55) v2(79.76,94.51) v2(79.76,93.47) v2(79.76,92.44) v2(86.14,83.8)
A_INPUT_HI: length 52.7
  Top Layer w0.4: U24.1 94.66,49.83 98.81,53.97 98.81,78.9 U1.6 91.73,75.82 83.61,75.82 R2.1
B: length 25.9
  Top Layer w0.22: U24.9 69.47,36.79 v2(69.47,30.99) ; v2(61.34,22.86) 61.29,22.81 U26.1
  Bottom Layer w0.22: v2(61.34,22.86) v2(69.47,30.99)
B1: length 15
  Top Layer w0.22: U17.18 34.38,50.46 U12.16
B2: length 17.8
  Top Layer w0.22: U12.15 35.03,52.35 U17.17
B3: length 20.6
  Top Layer w0.22: U12.14 35.68,54.24 U17.16
B4: length 23.4
  Top Layer w0.22: U17.15 36.32,56.13 U12.13
B5: length 26.2
  Top Layer w0.22: U17.14 36.97,58.02 U12.12
B6: length 29
  Top Layer w0.22: U12.11 37.62,59.91 U17.13
B7: length 31.9
  Top Layer w0.22: U17.12 38.28,61.8 U12.10
B8: length 34.7
  Top Layer w0.22: U12.9 38.93,63.69 U17.11
B9: length 38.9
  Top Layer w0.22: 42.38,38.03 42.38,39.67 39.62,42.42 39.62,65.53 U12.8
B10: length 41.7
  Top Layer w0.22: U12.7 40.26,67.43 40.26,42.8 43.03,40.03 43.03,38.03
B11: length 44.5
  Top Layer w0.22: U12.6 40.89,69.34 40.89,43.18 43.68,40.4 43.68,38.03
B12: length 47.3
  Top Layer w0.22: 44.32,38.03 44.32,40.77 41.53,43.56 41.53,71.24 U12.5
CC1: length 7.2
  Top Layer w0.3: R23.2 5.19,32.15 5.86,31.48 USB1.4
CC2: length 6.7
  Top Layer w0.3: USB1.10 5.87,28.48 5.19,27.8 R24.2
GPIO2: length 35.8
  Top Layer w0.22: v2(13.08,6.1) 20.56,6.1 21.71,4.94 33.52,4.94 38.6,10.03 U13.4
  Bottom Layer w0.22: v2(13.08,6.1) 13.08,4.41 R28.2
GPIO3: length 24.9
  Top Layer w0.22: U13.5 39,10.04 38.92,9.97 38.92,9.89 33.35,4.32 v2(24.02,4.32) 23.79,4.09 SW2.1
GPIO4: length 13.2
  Top Layer w0.22: H1.3 39.4,5.44 U13.6
GPIO5: length 12.5
  Top Layer w0.22: H1.2 39.8,3.7 U13.7
GPIO6: length 20.3
  Top Layer w0.22: U13.8 40.2,10.35 46.23,4.32 v2(50.82,4.32) 50.82,2.98 SW3.1
GPIO7: length 52.2
  Top Layer w0.22: FPC1.1 v2(75.28,11.12) ; U13.9 40.6,10.71 46.45,4.85 53.95,4.85 58.29,0.51 68.66,0.51 H3.3
  Bottom Layer w0.22: v2(75.28,11.12) 75.28,7.13 H3.3
GPIO8: length 49.4
  Top Layer w0.22: FPC1.3 v2(76.28,11.12) ; H3.4 72.36,5.33 49.15,5.33 41.4,13.08 U13.11
  Bottom Layer w0.22: H3.4 76.28,5.59 v2(76.28,11.12)
GPIO9: length 50.8
  Top Layer w0.22: U13.12 41.8,13.32 49.28,5.84 74.39,5.84 H3.5 ; FPC1.5 v2(77.28,11.12)
  Bottom Layer w0.22: H3.5 77.28,4.05 v2(77.28,11.12)
GPIO10: length 66.1
  Top Layer w0.22: U26.5 59.18,18.8 58.42,18.03 v2(58.42,8) ; FPC1.7 v2(78.28,11.12) ; H3.6 76.29,6.48 v2(58.42,6.48) 49.53,6.48 42.2,13.81 U13.13
  Bottom Layer w0.22: v2(58.42,8) v2(58.42,6.48) ; H3.6 78.28,4.49 v2(78.28,11.12)
GPIO11: length 71.7
  Top Layer w0.22: FPC1.9 79.28,8.19 78.2,7.11 ; 78.2,7.11 H3.7 ; 78.2,7.11 55.33,7.11 ; 55.33,7.11 55.33,22.18 56.01,22.86 59.31,22.86 59.77,22.4 U26.4 ; 55.33,7.11 49.66,7.11 42.6,14.17 U13.14
GPIO14: length 15.9
  Top Layer w0.22: U13.17 44.34,17.63 44.48,17.49 45.35,17.49 v2(45.35,17.5) ; v2(45.75,29.77) 45.62,29.9 45.62,31.16
  Bottom Layer w0.22: v2(45.35,17.5) 45.97,18.13 45.97,28.45 45.75,28.67 v2(45.75,29.77)
GPIO15: length 14.9
  Top Layer w0.22: 44.97,31.16 v2(44.97,29.77) ; U13.18 v2(44.7,18.03)
  Bottom Layer w0.22: v2(44.97,29.77) 44.96,29.75 44.96,28.83 45.59,28.19 45.59,26.29 45.61,26.27 45.61,18.94 v2(44.7,18.03)
GPIO16: length 10.4
  Top Layer w0.22: 44.32,31.16 44.32,28.07 44.49,27.9 44.49,21.93 44.2,21.63 U13.27
GPIO17: length 9.3
  Top Layer w0.22: U13.28 43.68,22.16 U21.5
GPIO18: length 8.4
  Top Layer w0.22: 42.6,22.98 42.6,25.07 43.03,25.5 43.03,31.16
GPIO19: length 8.4
  Top Layer w0.22: 42.2,22.98 42.2,25.18 42.54,25.53 42.54,26.67 42.38,26.84 42.38,31.16
GPIO20: length 8.5
  Top Layer w0.22: 41.8,22.98 41.8,25.34 42.1,25.65 42.1,26.55 41.72,26.93 41.72,31.16
GPIO21: length 9.8
  Top Layer w0.22: 38.28,31.16 38.28,29.92 41.78,26.42 41.78,25.78 41.4,25.4 41.4,22.98
GPIO22: length 9.4
  Top Layer w0.22: 40.6,22.98 40.6,26.71 37.62,29.69 37.62,31.16
GPIO23: length 9.5
  Top Layer w0.22: 40.2,22.98 40.2,26.6 36.97,29.83 36.97,31.16
GPIO24: length 9.8
  Top Layer w0.22: U17.6 36.32,29.97 39.8,26.49 39.8,22.98
GPIO25: length 9.7
  Top Layer w0.22: 35.68,31.16 35.68,30.11 39.4,26.39 39.4,22.98
GPIO26_ADC0: length 10
  Top Layer w0.22: U17.4 35.03,30.25 39,26.28 39,22.98
GPIO27_ADC1: length 10.1
  Top Layer w0.22: 38.6,22.98 38.6,26.17 34.38,30.4 U17.3
GPIO28_ADC2: length 10.4
  Top Layer w0.22: U17.2 33.72,30.23 36.14,27.81 36.45,27.81 38.2,26.06 38.2,22.98
GPIO29_ADC3: length 46.4
  Top Layer w0.22: v2(37.66,24.41) 37.8,24.27 37.8,22.98
  Bottom Layer w0.22: v2(37.66,24.41) 37.79,24.41 42.8,19.4 42.8,9.14 41.91,8.25 20.78,8.25 18,5.47 R29.2
INPUT_HI: length 48.1
  Top Layer w0.4: R10.1 72.39,69.82 72.39,60.2 77.34,55.25 82.17,55.25 U24.3 87.59,47.33 85.05,44.79 U24.13
OR: length 50.1
  Top Layer w0.22: U12.4 42.16,73.15 42.16,43.94 44.97,41.13 44.97,38.03
POL: length 52.9
  Top Layer w0.22: 45.62,38.03 45.62,41.5 42.8,44.32 42.8,75.05 U12.3
QSPI_SCLK: length 7.7
  Top Layer w0.22: U23.6 31.41,15.53 32.38,16.51 33.6,16.51 35.52,18.43 U13.52
QSPI_SD0: length 6.3
  Top Layer w0.22: U13.53 35.58,18.03 33.68,16.13 33.27,16.13 32.68,15.53 U23.5
QSPI_SD1: length 17.7
  Top Layer w0.22: U23.2 30.14,5.93 30.48,5.59 33.15,5.59 33.91,6.35 33.91,15.45 35.69,17.23 U13.55
QSPI_SD2: length 13.2
  Top Layer w0.22: U13.54 35.63,17.63 33.53,15.53 33.53,11.81 31.41,9.69 U23.3
QSPI_SD3: length 9.2
  Top Layer w0.22: U23.7 30.14,15.66 31.37,16.89 33.53,16.89 35.47,18.83 U13.51
QSPI_SS: length 21.9
  Top Layer w0.22: R17.2 28.85,6.99 U23.1 28.87,5.93 29.53,5.27 33.33,5.27 34.29,6.22 34.29,15.38 35.75,16.83 U13.56
REF_IN+: length 45.9
  Top Layer w0.4: R13.2 29.19,72.54 NOREF.1 29.21,90.81 30.86,92.46 35.56,92.46 U12.36
RUN: length 1.2
  Top Layer w0.22: NOREF#7.1 44.68,21.23 U13.26
RX: length 41.4
  Top Layer w0.22: U13.3 38.2,11.78 36.96,10.54 v2(35.05,10.54)
  Bottom Layer w0.22: 3.5,14.87 8.21,10.16 28.07,10.16 28.45,10.54 v2(35.05,10.54)
SCL0: length 66.8
  Top Layer w0.22: U13.16 44.24,17.23 45.09,16.38 45.09,13.21 49.15,9.14 53.47,9.14 54.36,10.03 54.36,22.73 58.29,26.67 59.96,26.67 H5.3 ; FPC1.8 78.78,16.6 65.53,29.84 63.13,29.84 H5.3 ; H5.3 61.87,31.37 R21.2
SDA0: length 68.8
  Top Layer w0.22: FPC1.6 77.78,16.71 65.9,28.59 H5.4 61.35,25.53 58.04,25.53 54.86,22.35 54.86,9.78 53.72,8.64 48.9,8.64 44.58,12.95 44.58,16.38 44.13,16.83 U13.15
  Bottom Layer w0.22: H5.4 64.41,31.48 v2(61.6,34.29)
STATUS: length 55.5
  Top Layer w0.22: U12.2 43.43,76.96 43.43,44.7 46.28,41.86 U21.12
TX: length 41.3
  Top Layer w0.22: U13.2 37.8,12.02 37.21,11.43 v2(35.05,11.43)
  Bottom Layer w0.22: v2(35.05,11.43) 28.32,11.43 27.81,10.92 9.99,10.92 H6.3
USB_DM: length 18.9
  Top Layer w0.22: 8.64,29.98 8.64,29.98 8.64,30.73 8.39,30.98 USB1.5 ; 8.64,29.98 USB1.7 ; 8.64,29.98 10.16,29.98 18.86,21.27 R9.1
USB_DP: length 21.2
  Top Layer w0.22: USB1.6 6.1,30.48 5.84,30.22 5.84,29.72 6.08,29.48 USB1.8 9.86,29.48 R8.1
V_DIV: length 64.2
  Top Layer w0.4: 79.12,67.58 72.52,74.19 72.52,81.15 64.52,89.15 58.42,89.15 56.19,91.38 CN2.1 52.89,93.22 39.5,93.22 37.46,95.25 H2.5
V_INPUT_HI: length 29.1
  Top Layer w0.4: 94.23,61.21 U7.6 ; 94.23,61.21 91.69,63.75 U7.2 ; 94.23,61.21 94.23,55.63 91.19,52.58 v2(86.87,52.58)
  Bottom Layer w0.4: U24.5 82.51,51.01 84.07,52.58 v2(86.87,52.58)
X0: length 23.7
  Top Layer w0.4: U24.12 85.6,39.12 89.41,39.12 93.79,34.73 93.79,29.25 H4.5
X1: length 16.8
  Top Layer w0.4: U24.14 94.74,35.06 94.74,30.84 H4.6
X2: length 13.2
  Top Layer w0.4: U24.15 96.5,35.84 H4.7
X3: length 28
  Top Layer w0.4: H4.4 92.71,27.79 92.71,34.54 89.03,38.23 83.95,38.23 U24.11
XIN: length 13.2
  Top Layer w0.22: C27.1 50.72,11.4 X2.1 50.25,13.76 48.39,15.62 R19.1 47.61,18.83 U13.20
XOUT: length 7.6
  Top Layer w0.22: R18.1 50.8,20.05 R19.2 47.57,19.23 U13.21
Y3: length 36.8
  Top Layer w0.4: v2(90.04,46.99) 98.04,38.99 98.04,23 H4.3
  Bottom Layer w0.4: U24.4 85.05,47.79 85.85,46.99 v2(90.04,46.99)
$1N916: length 6.8
  Top Layer w0.3: U12.23 52.96,47.37 X1.2
$1N922: length 6.9
  Top Layer w0.3: U12.22 52.7,44.83 X1.1
$1N1357: length 18.8
  Top Layer w0.4: U12.38 49.27,87.12 63.22,87.12 U15.2
$1N1363: length 8.4
  Top Layer w0.4: U15.1 52.59,82.93 U12.37
$1N1918: length 12.6
  Top Layer w0.4: U12.30 48.77,65.15 52.83,61.09 R11.1
$1N2068: length 8.3
  Top Layer w0.4: U19.1 52.78,70.23 U12.32
$1N2072: length 15.5
  Top Layer w0.4: U19.2 67.5,69.95 U18.2 62.54,61.09 R11.2
$1N4962: length 10.2
  Top Layer w0.5: U20.6 18.27,63.34 R12.1
$1N5333: length 11.2
  Top Layer w0.5: C18.1 25.65,62.31 R13.1 25.68,62.36 R14.2 R12.2
$1N7971: length 12.2
  Top Layer w0.4: U7.3 88.82,60.85 D3.1 82.68,57.38 R7.2 R6.1
$1N20556: length 3
  Top Layer w0.3: LED3.2 3.19,42.64 R30.2
$1N26767: length 5.6
  Top Layer w0.4: U12.31 50.86,67.69 U18.1
$1N28381: length 11.3
  Top Layer w0.4: R3.1 R4.2 87.62,33.68 84.53,30.59 82.03,30.59 U2.3
$1N51634: length 12.2
  Top Layer w0.4: U16.1 57.46,79.67 R10.2 48.36,77.11 U12.35
$1N51676: length 12.2
  Top Layer w0.4: R1.1 R2.2 85.36,87.27 U1.2
$1N71598: length 16.5
  Top Layer w0.4: USB1.2 v2(9.23,32.63) ; USB1.11 v2(9.23,27.83)
  Bottom Layer w0.4: v2(9.23,27.83) v2(9.23,32.63) 13.18,36.58 v2(15.47,36.58)
$1N71599: length 16.5
  Top Layer w0.3: U27.8 19.69,33.65 19.43,33.91 19.43,35.71 D5.1 18.57,37.24 19.05,37.72 21.34,37.72 22.23,36.82 R27.2 22.64,35.91 U27.5
  Top Layer w0.5: D4.1 24.65,38.44 C29.2 24.53,36.32 R27.2
$1N71606: length 1.8
  Top Layer w0.3: U27.6 20.33,35.92 20.73,36.32
$1N71609: length 3.2
  Top Layer w0.3: U27.4 25.25,34.15 U28.1
$1N71648: length 14.6
  Top Layer w0.22: U13.47 34.53,20.43 33.91,19.81 23.43,19.81 R8.2
$1N71649: length 14.6
  Top Layer w0.22: U13.46 34.29,20.83 33.78,20.32 23.43,20.32 R9.2
$1N71700: length 4.6
  Top Layer w0.22: X2.3 52.92,17.62 C22.1 R18.2
$1N71710: length 8.7
  Top Layer w0.22: R17.1 23.76,6.99 R16.1 17.79,9.53 SW1.2
$1N71729: length 3.2
  Top Layer w0.3: U28.2 25.26,33.15 U27.2
$1N71730: length 4.2
  Top Layer w0.3: R26.1 R25.2 17.78,32.65 U27.10
$1N77886: length 6.1
  Top Layer w0.5: C14.2 13.59,41.28 14.73,40.13 17.27,40.13 17.95,40.81 U14.5
$1N77891: length 2.6
  Top Layer w0.5: U14.3 13.89,43.99 C14.1
$1N87374: length 8
  Top Layer w0.5: R14.1 6.61,60.66 R15.1
$1N122348:
  vias: v2(11.2,4.33)
$1N122459:
  vias: v2(16.2,4.33)

## Copper pours and planes (outline as drawn; the poured copper is in the pictures)
AGND on Top Layer: 43.82,97.75 49.4,97.75 49.4,95.12 43.82,95.12
AGND on Top Layer: -1.91,101.85 101.85,101.85 101.85,-2.41 -1.91,-2.41
AGND on Top Layer: 88.39,99.69 93,99.69 93,91.59 88.39,91.59
AGND on Bottom Layer: -3.43,103.76 103.5,103.76 103.5,-4.7 -3.43,-4.7
GND on Top Layer: 0,100.08 36.05,100.08 36.05,53.85 63.25,53.85 63.25,32.39 76.96,18.67 88.55,18.67 100,7.22 100,0 0,0
GND on Top Layer: 17.45,98.11 28.19,98.11 28.19,74.42 17.45,74.42
GND on Bottom Layer: 0,100.08 36.05,100.08 36.05,53.85 63.25,53.85 63.25,32.39 76.96,18.67 88.55,18.67 100,7.22 100,0 0,0
A_DIV on Top Layer: 62.45,99.67 87.12,99.67 87.12,91.57 62.45,91.57
A_DIV on Top Layer: 42.67,99.69 63.08,99.69 63.08,98.04 42.67,98.04
A_DIV on Top Layer: 39.12,99.69 43.43,99.69 43.43,95.5 39.12,95.5
A_DIV on Bottom Layer: 42.67,99.69 63.08,99.69 63.08,98.04 42.67,98.04
A_DIV on Bottom Layer: 39.12,99.69 43.43,99.69 43.43,95.5 39.12,95.5
A_DIV on Bottom Layer: 62.45,99.67 87.12,99.67 87.12,91.57 62.45,91.57
A_DIV on Bottom Layer: 83.95,92.33 90.51,92.33 90.51,79.63 83.95,79.63

Small or netless copper shapes (teardrops, artwork), in the pictures only: 313 on Top Layer, 130 on Bottom Layer

## Text on the board
Top Silkscreen Layer: + | - | +5V | -5V | REF | VD | AD | VIN | GND | AGND | 3V3 | IO7 | IO8 | IO9 | IO10 | IO11 | TX | RX | SCL | SDA | X2 | X1 | X0 | X3 | Y3 | Y2 | IO4 | IO5
